# EAGLE design TC4plus (EAGLE 9.1.0)
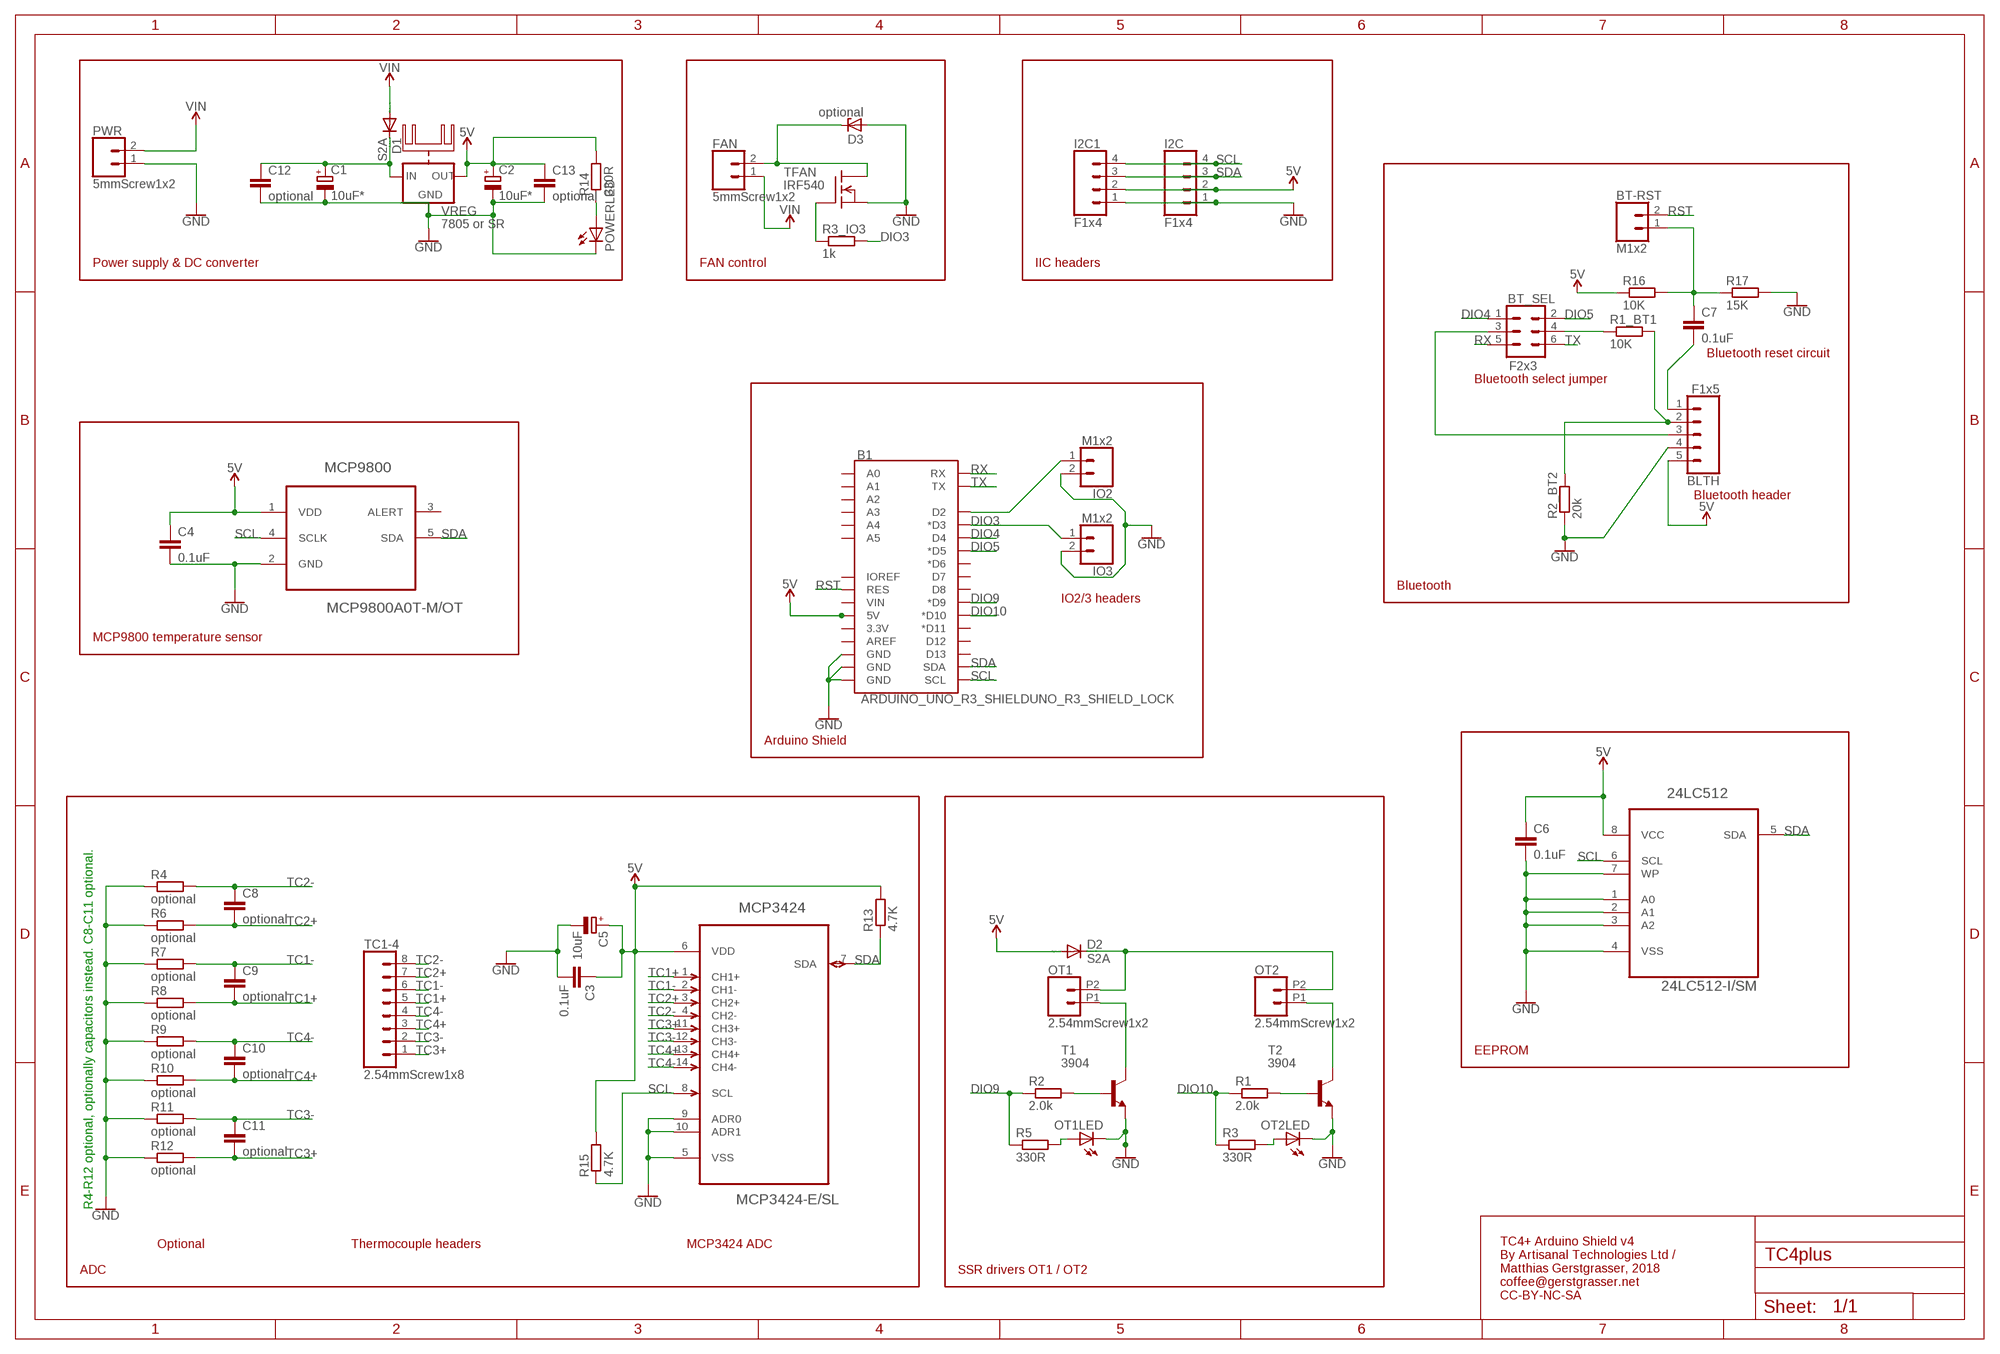
[diagram p0: schematic, sheet 1]

## Parts
24LC512  24LC512-I/SM  [SOIC127P794X203-8N]
B1  ARDUINO_UNO_R3_SHIELDUNO_R3_SHIELD_LOCK  [UNO_R3_SHIELD_LOCK]
BLTH  F1x5  CONN_05LOCK  [1X05_LOCK]
BT-RST  M1x2  CONN_02  [1X02]
BT_SEL  F2x3  CONN_03X2FEMALE  [2X3]
C1  10uF*  CPOL-EUE2-5  [E2-5]
C2  10uF*  CPOL-EUE2-5  [E2-5]
C3  0.1uF  C-EUC0603  [C0603]
C4  0.1uF  C-EUC0603  [C0603]
C5  10uF  CPOL-EUA/3216-18R  [A/3216-18R]
C6  0.1uF  C-EUC0603  [C0603]
C7  0.1uF  C-EUC0603  [C0603]
C8  optional  C-EUC0603  [C0603]
C9  optional  C-EUC0603  [C0603]
C10  optional  C-EUC0603  [C0603]
C11  optional  C-EUC0603  [C0603]
C12  optional  C-EU025-025X050  [C025-025X050]
C13  optional  C-EU025-025X050  [C025-025X050]
D1  S2A  DIODE-DO214AA  [DO214AA]
D2  S2A  DIODE-DO214AA  [DO214AA]
D3  optional  ZENER-DIODESMB  [SMB]
FAN  5mmScrew1x2  CONN_025MM  [SCREWTERMINAL-5MM-2]
I2C  F1x4  CONN_04LOCK  [1X04_LOCK]
I2C1  F1x4  CONN_04LOCK  [1X04_LOCK]
IO2  M1x2  CONN_02  [1X02]
IO3  M1x2  CONN_02  [1X02]
MCP3424  MCP3424-E/SL  [SOIC127P600X175-14N]
MCP9800  MCP9800A0T-M/OT  [SOT95P280X145-5N]
OT1  2.54mmScrew1x2  CONN_022.54MM_SCREWTERM  [1X02_2.54_SCREWTERM]
OT1LED  LEDCHIP-LED0603  [CHIP-LED0603]
OT2  2.54mmScrew1x2  CONN_022.54MM_SCREWTERM  [1X02_2.54_SCREWTERM]
OT2LED  LEDCHIP-LED0603  [CHIP-LED0603]
POWERLED  LEDCHIP-LED0603  [CHIP-LED0603]
PWR  5mmScrew1x2  CONN_025MM  [SCREWTERMINAL-5MM-2]
R1  2.0k  R-EU_R0603  [R0603]
R1_BT1  10K  R-EU_R0603  [R0603]
R2  2.0k  R-EU_R0603  [R0603]
R2_BT2  20k  R-EU_R0603  [R0603]
R3  330R  R-EU_R0603  [R0603]
R3_IO3  1k  R-EU_R0603  [R0603]
R4  optional  R-EU_R0603  [R0603]
R5  330R  R-EU_R0603  [R0603]
R6  optional  R-EU_R0603  [R0603]
R7  optional  R-EU_R0603  [R0603]
R8  optional  R-EU_R0603  [R0603]
R9  optional  R-EU_R0603  [R0603]
R10  optional  R-EU_R0603  [R0603]
R11  optional  R-EU_R0603  [R0603]
R12  optional  R-EU_R0603  [R0603]
R13  4.7K  R-EU_R0603  [R0603]
R14  330R  R-EU_R0603  [R0603]
R15  4.7K  R-EU_R0603  [R0603]
R16  10K  R-EU_R0603  [R0603]
R17  15K  R-EU_R0603  [R0603]
T1  3904  MMBT3904LT1-NPN-SOT23-BEC  [SOT23-BEC]
T2  3904  MMBT3904LT1-NPN-SOT23-BEC  [SOT23-BEC]
TC1-4  2.54mmScrew1x8  CONN_08"  [1X08]
TFAN  IRF540  [TO220]
VREG  7805 or SR  78XXH  [78XXH]

## Nets
5V: 24LC512.8(VCC) B1.5V BLTH.5 C2.+ C3.1 C4.1 C5.+ C6.1 C13.1 D2.A I2C1.2 I2C.2 MCP3424.6(VDD) MCP9800.1(VDD) R13.2 R14.2 R15.2 R16.1 VREG.OUT
DC-: D3.C FAN.2 TFAN.2(D)
DIO3: B1.D3(*D3) IO3.1 R3_IO3.2
DIO4: B1.D4 BT_SEL.1
DIO5: B1.D5(*D5) BT_SEL.2
DIO9: B1.D9(*D9) R2.1 R5.1
DIO10: B1.D10(*D10) R1.1 R3.1
GND: 24LC512.1(A0) 24LC512.2(A1) 24LC512.3(A2) 24LC512.4(VSS) 24LC512.7(WP) B1.GND@0(GND) B1.GND@1(GND) B1.GND@2(GND) BLTH.4 C1.- C2.- C3.2 C4.2 C5.- C6.2 C12.2 C13.2 D3.A I2C1.1 I2C.1 IO2.2 IO3.2 MCP3424.5(VSS) MCP3424.9(ADR0) MCP3424.10(ADR1) MCP9800.2(GND) OT1LED.C OT2LED.C POWERLED.C PWR.1 R2_BT2.1 R4.1 R6.1 R7.1 R8.1 R9.1 R10.1 R11.1 R12.1 R17.2 T1.E T2.E TFAN.3(S) VREG.GND
N$1: R2.2 T1.B
N$2: BLTH.2 R1_BT1.2 R2_BT2.2
N$3: BT_SEL.4 R1_BT1.1
N$4: BLTH.3 BT_SEL.3
N$5: R1.2 T2.B
N$7: R3_IO3.1 TFAN.1(G)
N$11: BLTH.1 C7.2
N$12: OT2LED.A R3.2
N$13: POWERLED.A R14.1
N$14: OT1LED.A R5.2
N$15: BT-RST.1 C7.1 R16.2 R17.1
N$16: C1.+ C12.1 D1.C VREG.IN
N$17: B1.D2 IO2.1
OT1-: OT1.P1 T1.C
OT2-: OT2.P1 T2.C
OT12+: D2.C OT1.P2 OT2.P2
RST: B1.RES BT-RST.2
RX: B1.RX BT_SEL.5
SCL: 24LC512.6(SCL) B1.SCL I2C1.4 I2C.4 MCP3424.8(SCL) MCP9800.4(SCLK) R15.1
SDA: 24LC512.5(SDA) B1.SDA I2C1.3 I2C.3 MCP3424.7(SDA) MCP9800.5(SDA) R13.1
TC1+: C9.2 MCP3424.1(CH1+) R8.2 TC1-4.5
TC1-: C9.1 MCP3424.2(CH1-) R7.2 TC1-4.6
TC2+: C8.2 MCP3424.3(CH2+) R6.2 TC1-4.7
TC2-: C8.1 MCP3424.4(CH2-) R4.2 TC1-4.8
TC3+: C11.2 MCP3424.11(CH3+) R12.2 TC1-4.1
TC3-: C11.1 MCP3424.12(CH3-) R11.2 TC1-4.2
TC4+: C10.2 MCP3424.13(CH4+) R10.2 TC1-4.3
TC4-: C10.1 MCP3424.14(CH4-) R9.2 TC1-4.4
TX: B1.TX BT_SEL.6
VIN: D1.A FAN.1 PWR.2
Unconnected: B1.3.3V B1.A0 B1.A1 B1.A2 B1.A3 B1.A4 B1.A5 B1.AREF B1.D6(*D6) B1.D7 B1.D8 B1.D11(*D11) B1.D12 B1.D13 B1.IOREF B1.VIN MCP9800.3(ALERT)

## Notes on the sheet
- Power supply & DC converter | FAN control | IIC headers
- Bluetooth reset circuit
- Bluetooth select jumper
- Bluetooth header
- Bluetooth
- IO2/3 headers
- MCP9800 temperature sensor
- Arduino Shield
- EEPROM
- R4-R12 optional, optionally capacitors instead. C8-C11 optional.
- Optional | Thermocouple headers | MCP3424 ADC
- ADC | SSR drivers OT1 / OT2
- TC4+ Arduino Shield v4
  By Artisanal Technologies Ltd /
  Matthias Gerstgrasser, 2018
  coffee@gerstgrasser.net
  CC-BY-NC-SA

## Library data of the parts
24LC512 = Microchip_By_element14_Batch_1:24LC512-I/SM: 512K I2C Serial EEPROM; MPN: 24LC512-I/SM; OC_FARNELL: 9758038; OC_NEWARK: 62K0582; PACKAGE: SOIC-8; SUPPLIER: MICROCHIP
B1 = SparkFun-Boards:ARDUINO_UNO_R3_SHIELD: Arduino R3 Shield Footprint Shield form compatible with the Arduino Uno R3. SparkFun Products: MG2639 Cellular Shield <https://www.sparkfun.com/products/13120> MIDI Shield <https://www.sparkfun.com/products/12898> R3 Stackable Headers Kit <https://www.sparkfun.com/products/11417>
BLTH = SparkFun-Connectors:CONN_05: Multi connection point. Often used as Generic Header-pin footprint for 0.1 inch spaced/style header connections On any of the 0.1 inch spaced packages, you can populate with these: Break Away Headers - Straight <https://www.sparkfun.com/products/116> (PRT-00116) Break Away Male Headers - Right Angle <https://www.sparkfun.com/products/553> (PRT-00553) Female Headers <https://www.sparkfun.com/products/115> (PRT-00115) Break Away Headers - Machine Pin <https://www.sparkfun.com/products/117> (PRT-00117) Break Away Female Headers - Swiss Machine Pin <https://www.sparkfun.com/products/743> (PRT-00743) For SCREWTERMINALS and SPRING TERMINALS visit here: Screw Terimnals on SparkFun.com <https://www.sparkfun.com/search/results?term=Screw+Terminals> (5mm/3.5mm/2.54mm spacing) This device is also useful as a general connection point to wire up your design to another part of your project. Our various solder wires solder well into these plated through hole pads. Hook-Up Wire - Assortment (Stranded, 22 AWG) <https://www.sparkfun.com/products/11375> (PRT-11375) Hook-Up Wire - Assortment (Solid Core, 22 AWG) <https://www.sparkfun.com/products/11367> (PRT-11367) View the entire wire category on our website here <https://www.sparkfun.com/categories/141> Special notes: Molex polarized connector foot print use with SKU : PRT-08231 with associated crimp pins and housings. 1MM SMD Version SKU: PRT-10208
BT-RST IO2 IO3 OT1 OT2 = SparkFun-Connectors:CONN_02: Multi connection point. Often used as Generic Header-pin footprint for 0.1 inch spaced/style header connections On any of the 0.1 inch spaced packages, you can populate with these: Break Away Headers - Straight <https://www.sparkfun.com/products/116> (PRT-00116) Break Away Male Headers - Right Angle <https://www.sparkfun.com/products/553> (PRT-00553) Female Headers <https://www.sparkfun.com/products/115> (PRT-00115) Break Away Headers - Machine Pin <https://www.sparkfun.com/products/117> (PRT-00117) Break Away Female Headers - Swiss Machine Pin <https://www.sparkfun.com/products/743> (PRT-00743) For SCREWTERMINALS and SPRING TERMINALS visit here: Screw Terimnals on SparkFun.com <https://www.sparkfun.com/search/results?term=Screw+Terminals> (5mm/3.5mm/2.54mm spacing) This device is also useful as a general connection point to wire up your design to another part of your project. Our various solder wires solder well into these plated through hole pads. Hook-Up Wire - Assortment (Stranded, 22 AWG) <https://www.sparkfun.com/products/11375> (PRT-11375) Hook-Up Wire - Assortment (Solid Core, 22 AWG) <https://www.sparkfun.com/products/11367> (PRT-11367) View the entire wire category on our website here <https://www.sparkfun.com/categories/141> Special notes: Molex polarized connector foot print use with: PRT-08233 with associated crimp pins and housings. 2.54_SCREWTERM for use with PRT-10571. 3.5mm Screw Terminal footprints for PRT-08084 5mm Screw Terminal footprints for use with PRT-08432
BT_SEL = SparkFun-Connectors:CONN_03X2: Multi connection point. Often used as Generic Header-pin footprint for 0.1 inch spaced/style header connections You can populate with any combo of single row headers, but if you'd like an exact match, check these: Header - 2x3 (Male, 0.1") <https://www.sparkfun.com/products/12807> (PRT-12807) Header - 2x3 (Female, 0.1") <https://www.sparkfun.com/products/13010> (PRT-13010) 2x3 Pin Shrouded Header <https://www.sparkfun.com/products/10877> (PRT-10877) On any of the 0.1 inch spaced packages, you can populate with these: Break Away Headers - Straight <https://www.sparkfun.com/products/116> (PRT-00116) Break Away Male Headers - Right Angle <https://www.sparkfun.com/products/553> (PRT-00553) Female Headers <https://www.sparkfun.com/products/115> (PRT-00115) Break Away Headers - Machine Pin <https://www.sparkfun.com/products/117> (PRT-00117) Break Away Female Headers - Swiss Machine Pin <https://www.sparkfun.com/products/743> (PRT-00743) Special note: the shrouded connector mates well with our 3x2 ribbon cables: Ribbon Crimp Connector - 6-pin (2x3, Female) <https://www.sparkfun.com/products/10651> (PRT-10651) Ribbon Cable - 6 wire (15ft) <https://www.sparkfun.com/products/10646> (PRT-10646); PROD_ID: CONN-11566; VALUE: FEMALE 2x3
C1 C2 C5 = rcl:CPOL-EU: POLARIZED CAPACITOR, European symbol; SPICEPREFIX: C
C3 C4 C6-C13 = rcl:C-EU: CAPACITOR, European symbol; SPICEPREFIX: C
D1 D2 = diode:DIODE-: DIODE
D3 = diode:ZENER-DIODE: Z-Diode
FAN PWR = SparkFun-Connectors:CONN_02: Multi connection point. Often used as Generic Header-pin footprint for 0.1 inch spaced/style header connections On any of the 0.1 inch spaced packages, you can populate with these: Break Away Headers - Straight <https://www.sparkfun.com/products/116> (PRT-00116) Break Away Male Headers - Right Angle <https://www.sparkfun.com/products/553> (PRT-00553) Female Headers <https://www.sparkfun.com/products/115> (PRT-00115) Break Away Headers - Machine Pin <https://www.sparkfun.com/products/117> (PRT-00117) Break Away Female Headers - Swiss Machine Pin <https://www.sparkfun.com/products/743> (PRT-00743) For SCREWTERMINALS and SPRING TERMINALS visit here: Screw Terimnals on SparkFun.com <https://www.sparkfun.com/search/results?term=Screw+Terminals> (5mm/3.5mm/2.54mm spacing) This device is also useful as a general connection point to wire up your design to another part of your project. Our various solder wires solder well into these plated through hole pads. Hook-Up Wire - Assortment (Stranded, 22 AWG) <https://www.sparkfun.com/products/11375> (PRT-11375) Hook-Up Wire - Assortment (Solid Core, 22 AWG) <https://www.sparkfun.com/products/11367> (PRT-11367) View the entire wire category on our website here <https://www.sparkfun.com/categories/141> Special notes: Molex polarized connector foot print use with: PRT-08233 with associated crimp pins and housings. 2.54_SCREWTERM for use with PRT-10571. 3.5mm Screw Terminal footprints for PRT-08084 5mm Screw Terminal footprints for use with PRT-08432; SF_SKU: PRT-08432
I2C I2C1 = SparkFun-Connectors:CONN_04: Multi connection point. Often used as Generic Header-pin footprint for 0.1 inch spaced/style header connections On any of the 0.1 inch spaced packages, you can populate with these: Break Away Headers - Straight <https://www.sparkfun.com/products/116> (PRT-00116) Break Away Male Headers - Right Angle <https://www.sparkfun.com/products/553> (PRT-00553) Female Headers <https://www.sparkfun.com/products/115> (PRT-00115) Break Away Headers - Machine Pin <https://www.sparkfun.com/products/117> (PRT-00117) Break Away Female Headers - Swiss Machine Pin <https://www.sparkfun.com/products/743> (PRT-00743) For SCREWTERMINALS and SPRING TERMINALS visit here: Screw Terimnals on SparkFun.com <https://www.sparkfun.com/search/results?term=Screw+Terminals> (5mm/3.5mm/2.54mm spacing) This device is also useful as a general connection point to wire up your design to another part of your project. Our various solder wires solder well into these plated through hole pads. Hook-Up Wire - Assortment (Stranded, 22 AWG) <https://www.sparkfun.com/products/11375> (PRT-11375) Hook-Up Wire - Assortment (Solid Core, 22 AWG) <https://www.sparkfun.com/products/11367> (PRT-11367) View the entire wire category on our website here <https://www.sparkfun.com/categories/141> Special notes: Molex polarized connector foot print use with SKU : PRT-08231 with associated crimp pins and housings. 1MM SMD Version SKU: PRT-10208; PROD_ID: CONN-09696
MCP3424 = Microchip_By_element14_Batch_1:MCP3424-E/SL: Analog-to-Digital Converter; MPN: MCP3424-E/SL; OC_FARNELL: 1630424; OC_NEWARK: 54M4871; PACKAGE: SOIC-14; SUPPLIER: Microchip
MCP9800 = Microchip_By_element14_Batch_1:MCP9800A0T-M/OT: Temperature Sensor; MPN: MCP9800A0T-M/OT; OC_FARNELL: 1439485; OC_NEWARK: 58M8993; PACKAGE: SOT-5; SUPPLIER: MICROCHIP
OT1LED OT2LED POWERLED = led:LED: LED OSRAM: - CHIPLED LG R971, LG N971, LY N971, LG Q971, LY Q971, LO R971, LY R971 LH N974, LH R974 LS Q976, LO Q976, LY Q976 LO Q996 - Hyper CHIPLED LW Q18S LB Q993, LB Q99A, LB R99A - SideLED LS A670, LO A670, LY A670, LG A670, LP A670 LB A673, LV A673, LT A673, LW A673 LH A674 LY A675 LS A676, LA A676, LO A676, LY A676, LW A676 LS A679, LY A679, LG A679 - Hyper Micro SIDELED® LS Y876, LA Y876, LO Y876, LY Y876 LT Y87S - SmartLED LW L88C, LW L88S LB L89C, LB L89S, LG L890 LS L89K, LO L89K, LY L89K LS L896, LA L896, LO L896, LY L896 - TOPLED LS T670, LO T670, LY T670, LG T670, LP T670 LSG T670, LSP T670, LSY T670, LOP T670, LYG T670 LG T671, LOG T671, LSG T671 LB T673, LV T673, LT T673, LW T673 LH T674 LS T676, LA T676, LO T676, LY T676, LB T676, LH T676, LSB T676, LW T676 LB T67C, LV T67C, LT T67C, LS T67K, LO T67K, LY T67K, LW E67C LS E67B, LA E67B, LO E67B, LY E67B, LB E67C, LV E67C, LT E67C LW T67C LS T679, LY T679, LG T679 LS T770, LO T770, LY T770, LG T770, LP T770 LB T773, LV T773, LT T773, LW T773 LH T774 LS E675, LA E675, LY E675, LS T675 LS T776, LA T776, LO T776, LY T776, LB T776 LHGB T686 LT T68C, LB T68C - Hyper Mini TOPLED® LB M676 - Mini TOPLED Santana® LG M470 LS M47K, LO M47K, LY M47K Source: http://www.osram.convergy.de LUXEON: - LUMILED® LXK2-PW12-R00, LXK2-PW12-S00, LXK2-PW14-U00, LXK2-PW14-V00 LXK2-PM12-R00, LXK2-PM12-S00, LXK2-PM14-U00 LXK2-PE12-Q00, LXK2-PE12-R00, LXK2-PE12-S00, LXK2-PE14-T00, LXK2-PE14-U00 LXK2-PB12-K00, LXK2-PB12-L00, LXK2-PB12-M00, LXK2-PB14-N00, LXK2-PB14-P00, LXK2-PB14-Q00 LXK2-PR12-L00, LXK2-PR12-M00, LXK2-PR14-Q00, LXK2-PR14-R00 LXK2-PD12-Q00, LXK2-PD12-R00, LXK2-PD12-S00 LXK2-PH12-R00, LXK2-PH12-S00 LXK2-PL12-P00, LXK2-PL12-Q00, LXK2-PL12-R00 Source: www.luxeon.com KINGBRIGHT: KA-3528ASYC Source: www.kingbright.com
R1 R1_BT1 R2 R2_BT2 R3 R3_IO3 R4-R17 = rcl:R-EU_: RESISTOR, European symbol; SPICEPREFIX: R
T1 T2 = transistor-neu-to92:*-NPN-: NPN Transistror
TC1-4 = SparkFun-Connectors:CONN_08: Multi connection point. Often used as Generic Header-pin footprint for 0.1 inch spaced/style header connections On any of the 0.1 inch spaced packages, you can populate with these: Break Away Headers - Straight <https://www.sparkfun.com/products/116> (PRT-00116) Break Away Male Headers - Right Angle <https://www.sparkfun.com/products/553> (PRT-00553) Female Headers <https://www.sparkfun.com/products/115> (PRT-00115) Break Away Headers - Machine Pin <https://www.sparkfun.com/products/117> (PRT-00117) Break Away Female Headers - Swiss Machine Pin <https://www.sparkfun.com/products/743> (PRT-00743) Arduino Stackable Header - 8 Pin <https://www.sparkfun.com/products/9279> (PRT-09279) For SCREWTERMINALS and SPRING TERMINALS visit here: Screw Terimnals on SparkFun.com <https://www.sparkfun.com/search/results?term=Screw+Terminals> (5mm/3.5mm/2.54mm spacing) This device is also useful as a general connection point to wire up your design to another part of your project. Our various solder wires solder well into these plated through hole pads. Hook-Up Wire - Assortment (Stranded, 22 AWG) <https://www.sparkfun.com/products/11375> (PRT-11375) Hook-Up Wire - Assortment (Solid Core, 22 AWG) <https://www.sparkfun.com/products/11367> (PRT-11367) View the entire wire category on our website here <https://www.sparkfun.com/categories/141> Special notes: Molex polarized connector foot print use with SKU : PRT-08231 with associated crimp pins and housings. 1MM SMD Version SKU: PRT-10208 NOTES ON THE VARIANTS LOCK and LOCK_LONGPADS... This footprint was designed to help hold the alignment of a through-hole component (i.e. 6-pin header) while soldering it into place. You may notice that each hole has been shifted either up or down by 0.005 of an inch from it's more standard position (which is a perfectly straight line). This slight alteration caused the pins (the squares in the middle) to touch the edges of the holes. Because they are alternating, it causes a "brace" to hold the component in place. 0.005 has proven to be the perfect amount of "off-center" position when using our standard breakaway headers. Although looks a little odd when you look at the bare footprint, once you have a header in there, the alteration is very hard to notice. Also,if you push a header all the way into place, it is covered up entirely on the bottom side.; PROD_ID: CONN-08438
TFAN = transistor-fet:IRF540: N-Channel Enhancement MOSFET (HEXFET); 100V; 28A; 0,077Ohm
VREG = 78xx_with_heatsink:78XXH: VOLTAGE REGULATOR

## Board
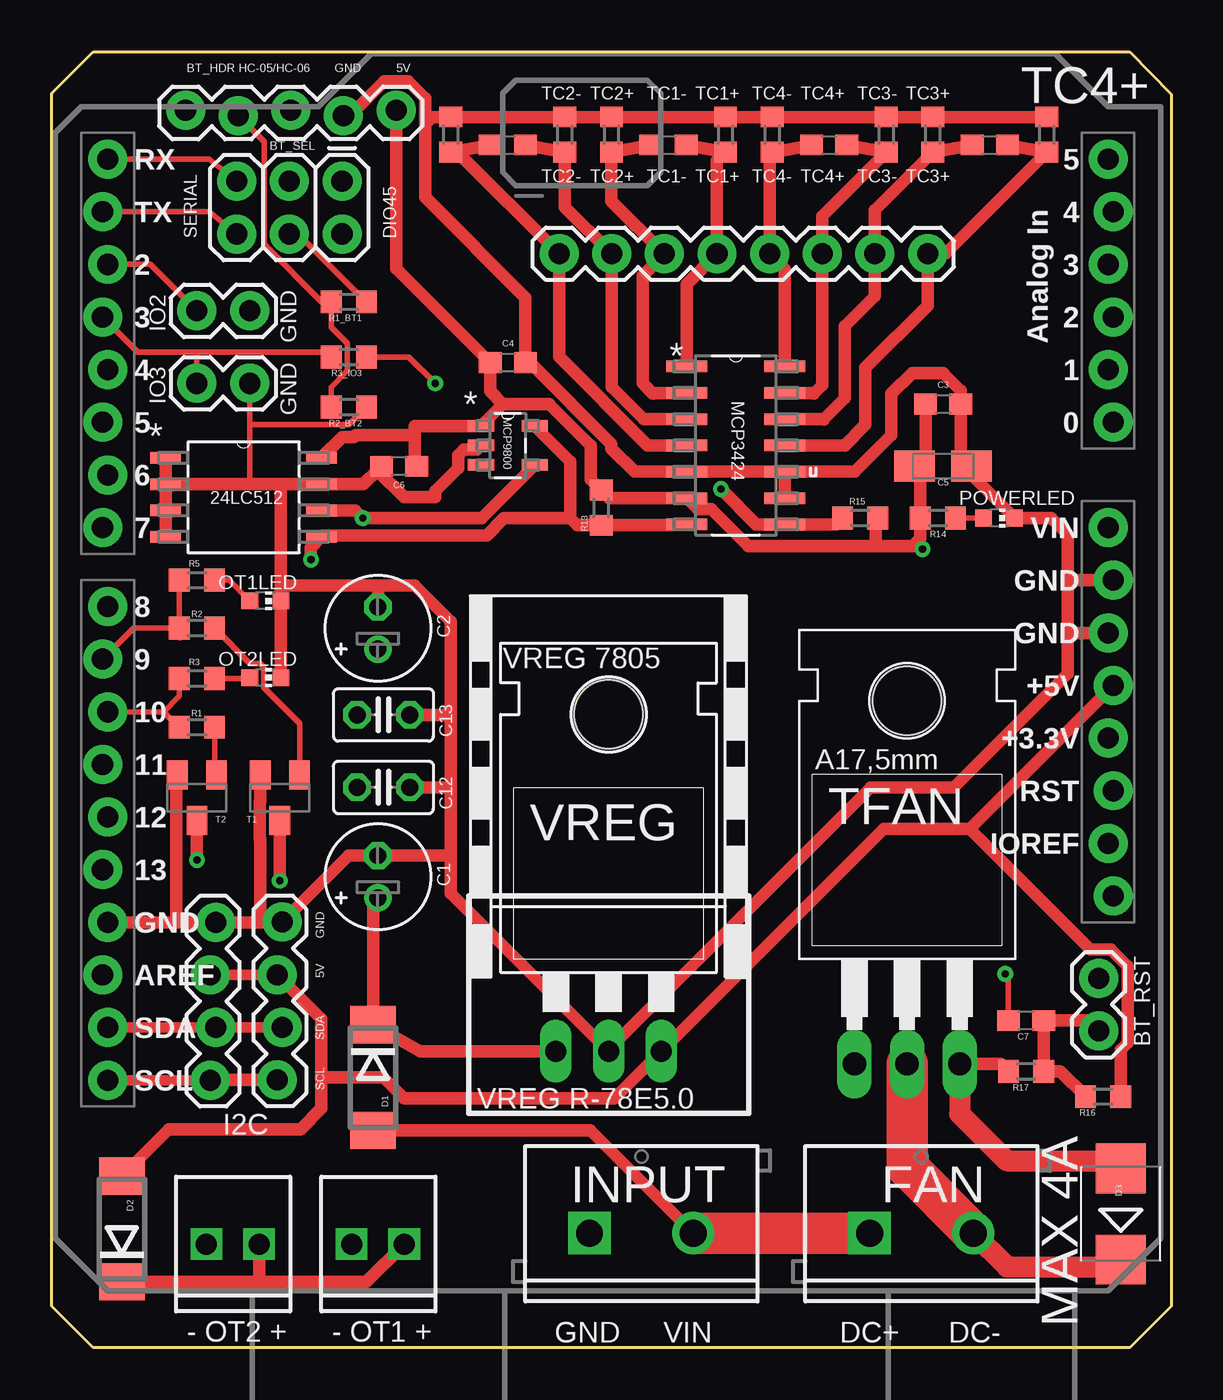
[diagram p1: board, top side]
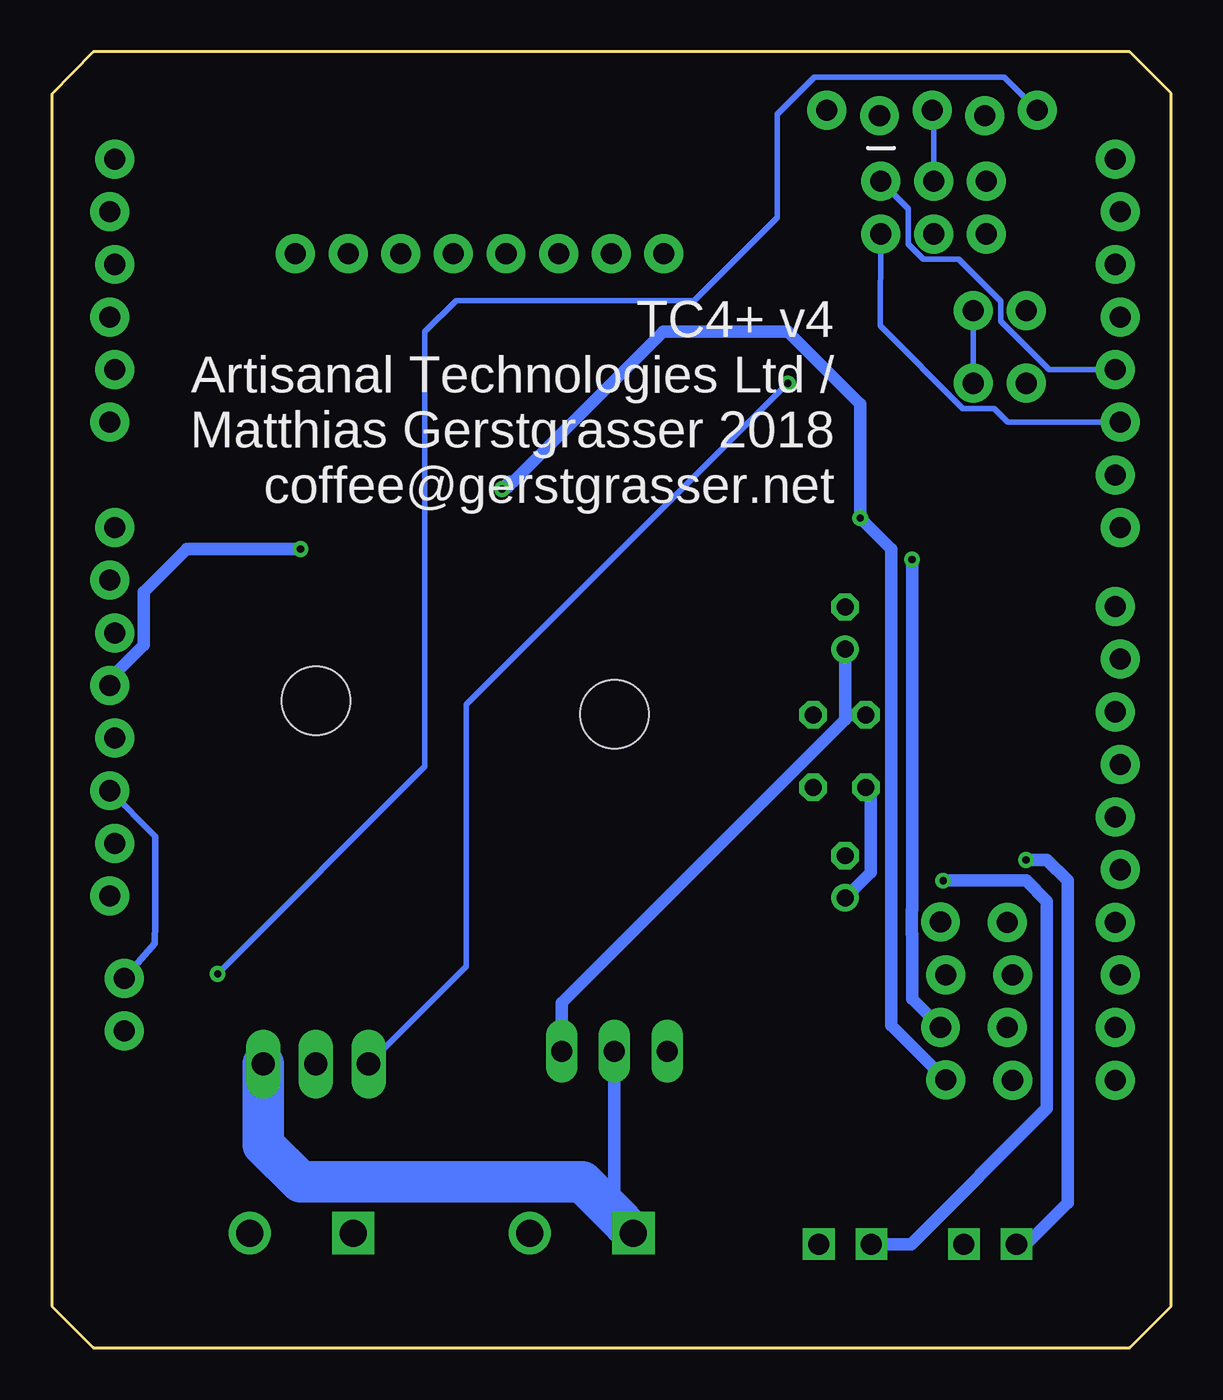
[diagram p2: board, bottom side, seen from below]

Size 54 x 62.54 mm. Coordinates in mm from the lower left corner, seen from the top.
Outline: 54,2 52,0 2,0 0,2 0,60.54 2,62.54 52,62.54 54,60.5 54,2
Copper layers (1*16): Top 0.035mm / dielectric 1.5mm / Bottom 0.035mm
Design rules "default": minimum track width 6mil, minimum drill 0.35mm, track to track 6mil, track to pad 6mil, pad to pad 6mil, via to via 6mil, smd to smd 6mil, copper to edge 40mil, drill to drill 6mil, minimum pad ring 10mil, minimum via ring 8mil, stop-mask expansion 4mil, vias tented up to drill 0mil, thermal gap 10mil

### Footprints (pad centres in the part's own frame; a part is rotated, then mirrored left to right if it is on the bottom)
SOIC127P794X203-8N = smd 1.473 x 0.559: 1 -3.759,1.905; 2 -3.759,0.635; 3 -3.759,-0.635; 4 -3.759,-1.905; 5 3.759,-1.905; 6 3.759,-0.635; 7 3.759,0.635; 8 3.759,1.905
UNO_R3_SHIELD_LOCK = drill 1.016 pad 1.88: 3.3V 24.13,-3.81; 5V 24.384,-1.27; A0 24.384,11.43; A1 24.13,13.97; A2 24.384,16.51; A3 24.13,19.05; A4 24.384,21.59; A5 24.13,24.13; AREF -24.384,-15.24; D2 -24.13,19.05; D3 -24.384,16.51; D4 -24.13,13.97; D5 -24.384,11.43; D6 -24.13,8.89; D7 -24.384,6.35; D8 -24.13,2.54; D9 -24.384,0; D10 -24.13,-2.54; D11 -24.384,-5.08; D12 -24.13,-7.62; D13 -24.384,-10.16; GND@0 24.13,1.27; GND@1 24.384,3.81; GND@2 -24.13,-12.7; IOREF 24.13,-8.89; NC 24.384,-11.43; RES 24.384,-6.35; RX -24.13,24.13; SCL -24.13,-20.32; SDA -24.13,-17.78; TX -24.384,21.59; VIN 24.13,6.35
1X05_LOCK = drill 1.016 pad 1.88: 1 0,0.127; 2 2.54,-0.127; 3 5.08,0.127; 4 7.62,-0.127; 5 10.16,0.127
1X02 = drill 1.016 pad 1.88: 1 0,0; 2 2.54,0
2X3 = drill 1.016 pad 1.88: 1 0,0; 2 0,2.54; 3 2.54,0; 4 2.54,2.54; 5 5.08,0; 6 5.08,2.54
E2-5 = drill 0.813 pad 1.27: + -1.016,0 | drill 0.813 pad 1.27 octagon: - 1.016,0
C0603 = smd 1.1 x 1: 1 -0.85,0; 2 0.85,0
A/3216-18R = smd 1.95 x 1.5: + 1.375,0; - -1.375,0
C025-025X050 = drill 0.813 octagon: 1 -1.27,0; 2 1.27,0
DO214AA = smd 1.8 x 2.2: A 2.55,0; C -2.55,0
SMB = smd 2.4 x 2.4: A 2.2,0; C -2.2,0
SCREWTERMINAL-5MM-2 = drill 1.3 pad 2.032 square: 1 0,0 | drill 1.3 pad 2.032: 2 5,0
1X04_LOCK = drill 1.016 pad 1.88: 1 0,0.127; 2 2.54,-0.127; 3 5.08,0.127; 4 7.62,-0.127
SOIC127P600X175-14N = smd 1.981 x 0.559: 1 -2.362,3.81; 2 -2.362,2.54; 3 -2.362,1.27; 4 -2.362,0; 5 -2.362,-1.27; 6 -2.362,-2.54; 7 -2.362,-3.81; 8 2.362,-3.81; 9 2.362,-2.54; 10 2.362,-1.27; 11 2.362,0; 12 2.362,1.27; 13 2.362,2.54; 14 2.362,3.81
SOT95P280X145-5N = smd 1.27 x 0.559: 1 -1.295,0.94; 2 -1.295,0; 3 -1.295,-0.94; 4 1.295,-0.94; 5 1.295,0.94
1X02_2.54_SCREWTERM = drill 1.016 square: P1 2.54,0; P2 0,0
CHIP-LED0603 = smd 0.8 x 0.8: A 0,-0.75; C 0,0.75
R0603 = smd 1 x 1.1: 1 -0.85,0; 2 0.85,0
SOT23-BEC = smd 1 x 1.4: B -0.95,-1.1; C 0,1.1; E 0.95,-1.1
1X08 = drill 1.016 pad 1.88: 1 0,0; 2 2.54,0; 3 5.08,0; 4 7.62,0; 5 10.16,0; 6 12.7,0; 7 15.24,0; 8 17.78,0
TO220 = drill 1.118 long: 1 -2.54,-6.35; 2 0,-6.35; 3 2.54,-6.35 | hole 3.302: 0,11.176
78XXH = drill 1.016 long: GND 0,-5.08; IN -2.54,-5.08; OUT 2.54,-5.08 | hole 3.302: 0,11.176

### Placement (x,y rotation side)
24LC512  9.25,41.04 0 top
B1  26.83,33.23 0 top
BLTH  6.45,59.59 0 top
BT-RST  50.5,15.29 90 top
BT_SEL  14,56.29 180 top
C1  15.73,22.73 90 top
C2  15.73,34.73 90 top
C3  43,45.54 0 top
C4  22,47.54 0 top
C5  43,42.54 180 top
C6  16.75,42.54 180 top
C7  47,15.79 180 top
C8  22,58.04 0 top
C9  29.75,58.04 0 top
C10  37.5,58.04 0 top
C11  45.25,58.04 0 top
C12  16,27.04 0 top
C13  16,30.54 0 top
D1  15.5,13.04 270 top
D2  3.38,5.73 90 top
D3  51.57,6.46 90 top
FAN  39.45,5.53 0 top
I2C  7.78,20.53 270 top
I2C1  11,20.54 270 top
IO2  7,50.04 0 top
IO3  7,46.54 0 top
MCP3424  33,43.54 0 top
MCP9800  22,43.54 0 top
OT1  17,5 180 top
OT1LED  10.3,36.04 270 top
OT2  10,5 180 top
OT2LED  10.3,32.34 270 top
POWERLED  45.7,40.04 270 top
PWR  25.94,5.53 0 top
R1  7,29.94 0 top
R1_BT1  14.33,50.47 180 top
R2  7,34.73 0 top
R2_BT2  14.33,45.39 180 top
R3  7,32.29 0 top
R3_IO3  14.33,47.81 180 top
R4  19.25,58.54 270 top
R5  7,37.04 0 top
R6  24.75,58.54 270 top
R7  27,58.54 270 top
R8  32.5,58.54 270 top
R9  34.75,58.54 270 top
R10  40.25,58.54 270 top
R11  42.5,58.54 270 top
R12  48,58.54 270 top
R13  26.5,40.54 90 top
R14  42.75,40.04 180 top
R15  39,40.04 0 top
R16  50.72,12.12 180 top
R17  47,13.33 180 top
T1  11,26.54 180 top
T2  7,26.54 180 top
TC1-4  42.25,52.79 180 top
TFAN  41.26,20.04 0 top
VREG  26.86,19.39 0 top

### Tracks (layer width: path | path; a pad name or v marks a point on that pad's centre or on a via)
5V  (via drill 0.35)
  Top 0.305: I2C1.2
  Top 0.508: I2C1.2 7.66,18 I2C.2
  Top 0.61: C3.1 42.15,43.09 C5.+ 41.9,42.24 R14.2 41.9,39.08 41.5,38.68 | D2.A 5.64,10.54 12,10.54 13,11.54 13,13.04 | I2C1.2 13,15.87 13,13.04 | 13,13.04 16,13.04 17,12.04 27.13,12.04 VREG.OUT 40.13,25.04 44.29,25.04 | 44.29,25.04 B1.5V | R16.1 51.57,14.38 51.9,14.71 51.9,18.41 51.08,19.23 50.11,19.23 44.29,25.04 | C6.1 17.5,42.64 17.5,44.04 | 17.5,44.04 17.5,44.48 MCP9800.1 21.77,45.54 | BLTH.5 16.61,52.08 C4.1 21.15,46.15 21.77,45.54 | v42,38.54 41.86,38.68 41.5,38.68 | 21.77,45.54 24,45.54 26,43.54 26,41.89 R13.2 26.89,41 MCP3424.6 31.17,40.47 31.82,40.47 33.61,38.68 39.75,38.68 | 39.75,38.68 41.5,38.68 | 24LC512.8 14.02,43.96 14.57,43.96 14.66,44.04 17.5,44.04 | 39.75,38.68 39.75,39.94 R15.2
  Bottom 0.61: B1.5V 51.21,32.27 49.56,33.92 49.56,36.48 47.5,38.54 v42,38.54 | VREG.OUT 29.4,16.64 15.73,30.31 | C13.1 15.5,30.54 15.73,30.31 | C2.+ 15.73,30.31
DC-
  Top 0.61: FAN.2 44.83,5.91
  Top 1.016: FAN.2 46.09,3.89 51.2,3.89 D3.C
  Top 2: TFAN.2 41.26,8.72 FAN.2
DIO3
  Top 0.254: B1.D3 4.15,48.04 7,48.04 | R3_IO3.2 13.25,48.04 7,48.04 | IO3.1 7,48.04
DIO4
  Bottom 0.254: BT_SEL.1 12.68,54.97 12.68,53.24 11.96,52.53 10.24,52.53 8.22,50.51 8.22,49.54 5.88,47.2 B1.D4
DIO5
  Bottom 0.254: B1.D5 7.88,44.66 8.55,45.32 10.05,45.32 14.04,49.32 BT_SEL.2
DIO9
  Top 0.254: R2.1 6.16,34.24 | B1.D9 3.95,34.73 R2.1 | R2.1 R5.1
DIO10
  Top 0.254: B1.D10 5.4,30.69 | 5.4,30.69 R1.1 | R3.1 6.15,31.44 5.4,30.69
GND
  Top 0.254: 11.68,41.85 11.5,41.68 | 8.54,41.71 8.5,41.68 | IO3.2 9.54,44.54 | 9.54,44.54 9.54,41.71 9.5,41.68 | R2_BT2.1 14.33,44.54 9.54,44.54
  Top 0.61: MCP3424.10 MCP3424.9 | 6,20.53 I2C.1 10,20.53 | 6,20.53 B1.GND@2 2.94,20.53 | 24LC512.4 24LC512.3 24LC512.2 | 24LC512.2 24LC512.1 | 24LC512.2 8.5,41.68 9.5,41.68 11,41.68 | 11,41.68 11.5,41.68 24LC512.7 15.04,41.68 15.7,42.34 | MCP3424.10 MCP3424.5 28.12,42.27 27,43.39 27,43.62 23.08,47.54 C4.2 22.85,50.68 18.01,55.53 18.01,59.04 | R17.2 45.79,13.69 TFAN.3 | 10,20.53 11.12,20.53 I2C1.1 14.33,23.75 C1.- 19.21,23.75 19.25,23.79 | MCP3424.10 38.73,42.27 40.5,44.04 40.5,46.04 41.5,47.04 43,47.04 43.85,46.19 C3.2 43.85,43.09 C5.- 44.4,42.09 POWERLED.C 48.21,40.04 49,39.25 49,36.79 | C6.2 15.7,42.34 | MCP9800.2 20.5,43.34 19.88,43.34 19.61,43.07 19.61,42.45 18.5,41.34 18.5,41.04 17,41.04 15.7,42.34 | OT2LED.C OT1LED.C 11.05,36.79 | 11.05,36.79 11.05,41.62 11,41.68 | 10,20.53 10.05,20.58 10.05,24.54 10.04,24.55 10.04,26.33 10.05,26.34 T1.E | T2.E 6,27.59 6,20.53 | 18.01,59.04 18.01,60.3 17.19,61.11 16.03,61.11 14.38,59.46 BLTH.4 | 18.01,59.04 18.36,59.39 R4.1 R6.1 R7.1 R8.1 R9.1 R10.1 R11.1 R12.1 | 19.25,23.79 19.25,21.92 VREG.GND 26.86,14.4 39.5,27.04 43.5,27.04 49,32.54 49,34.29 | 19.25,23.79 19.25,27.04 | 19.25,27.04 19.25,30.79 | 19.25,30.79 19.25,35.04 17.5,36.79 15.75,36.79 | C12.2 19.25,27.04 | C13.2 19,30.54 19.25,30.79 | 15.75,36.79 11.05,36.79 | C2.- 15.75,35.77 15.75,36.79 | 49,34.29 49,36.79 | B1.GND@1 49.25,37.04 49,36.79 | B1.GND@0 49.21,34.5 49,34.29
  Top 1.016: TFAN.3 43.8,11.29 46.06,9.03 51.2,9.03 D3.A
  Bottom 0.254: IO2.2 IO3.2
  Bottom 0.305: 27.02,5.61 PWR.1
  Bottom 0.61: 28.86,8.45 28.41,8 | VREG.GND 26.86,6.68 26.98,6.56
  Bottom 2: PWR.1 26.98,6.56 28.41,8 42,8 43.8,9.8 TFAN.3
N$1
  Top 0.254: T1.B 11.95,30.13 10.23,31.85 10.23,32.86 10.07,33.02 9.56,33.02 R2.2
N$2
  Top 0.254: R2_BT2.2 13.48,46.37 14.26,47.14 14.26,48.48 13.48,49.26 R1_BT1.2 13.02,50.47 10.24,53.24 10.24,56.79 10.25,56.8 10.25,58.2 BLTH.2
N$3
  Top 0.254: R1_BT1.1 11.9,53.75 BT_SEL.4
N$4
  Bottom 0.254: BLTH.3 11.46,59.62 BT_SEL.3
N$5
  Top 0.254: R1.2 7.85,27.74 T2.B
N$7  (via drill 0.35)
  Top 0.254: R3_IO3.1 17.23,47.81 v18.5,46.54
  Bottom 0.254: v18.5,46.54 34,31.04 34,18.41 TFAN.1
N$11  (via drill 0.35)
  Top 0.254: C7.2 46.15,17.89 v46,18.04
  Bottom 0.254: BLTH.1 8.05,61.32 17.22,61.32 19,59.54 19,54.54 23,50.54 34.5,50.54 36,49.04 36,28.04 v46,18.04
N$12
  Top 0.254: R3.2 9.5,32.29 OT2LED.A
N$13
  Top 0.254: R14.1 POWERLED.A
N$14
  Top 0.254: R5.2 8.55,37.04 OT1LED.A
N$15
  Top 0.61: R16.2 48.66,13.33 R17.1 C7.1 50,15.79 BT-RST.1
N$16
  Top 0.61: VREG.IN 17.78,14.31 D1.C 15.5,21.48 C1.+
  Bottom 0.61: C1.+ 14.5,22.94 14.5,26.81 C12.1
N$17
  Top 0.254: IO2.1 4.76,52.28 B1.D2
OT1-  (via drill 0.35)
  Top 0.61: T1.C v11,22.54
  Bottom 0.61: v11,22.54 7,22.54 6,21.54 6,11.54 12.54,5 OT1.P1
OT2-  (via drill 0.35)
  Top 0.61: T2.C v7,23.54
  Bottom 0.61: v7,23.54 6,23.54 5,22.54 5,7 7,5 OT2.P1
OT12+
  Top 0.61: D2.C 10,3.18 | 10,3.18 15.18,3.18 OT1.P2 | OT2.P2 10,3.18
RST
  Bottom 0.305: BT-RST.2 49.04,19.5 49,20.54 49,24.67 B1.RES
RX
  Top 0.254: B1.RX 7.6,57.36 BT_SEL.5
SCL  (via drill 0.35)
  Top 0.508: B1.SCL I2C.4
  Top 0.61: I2C.4 7.66,12.92 I2C1.4 | 24LC512.6 14.64,40.4 v15,40.04 20.73,40.04 MCP9800.4 | v32.29,41.43 33.99,39.73 MCP3424.8 37.84,39.73 R15.1
  Bottom 0.61: I2C1.4 13.5,15.55 13.5,38.54 v15,40.04 15,45.54 18.5,49.04 24.5,49.04 31.75,41.79 | 31.75,41.79 32,41.54 | v32.29,41.43 31.93,41.79 31.75,41.79
SDA  (via drill 0.35)
  Top 0.508: B1.SDA I2C.3 11.12,15.45 I2C1.3
  Top 0.61: v12.5,38.04 12.5,38.63 24LC512.5 13.08,39.21 20.98,39.21 21.81,40.04 25,40.04 | MCP9800.5 25,42.77 25,40.04 | 25,40.04 25.35,39.69 R13.1 30.6,39.69 MCP3424.7
  Bottom 0.61: I2C1.3 12.5,16.83 12.5,19.94 12.52,19.96 12.52,21.12 12.5,21.14 v12.5,38.04
TC1+
  Top 0.61: C9.2 R8.2 32.09,57.28 TC1-4.5 30.64,51.34 MCP3424.1
TC1-
  Top 0.61: C9.1 R7.2 27,55.34 TC1-4.6 28.5,51.74 28.5,46.54 29,46.04 29.04,46.08 MCP3424.2
TC2+
  Top 0.61: C8.2 R6.2 24.75,55.05 TC1-4.7 27.01,46.36 28.56,44.81 MCP3424.3
TC2-
  Top 0.61: C8.1 R4.2 19.57,57.69 TC1-4.8 24.47,47.82 28.75,43.54 MCP3424.4
TC3+
  Top 0.61: C11.2 R12.2 43.1,52.79 TC1-4.1 42.25,50.29 39.25,47.29 39.25,44.54 38.25,43.54 MCP3424.11
TC3-
  Top 0.61: C11.1 R11.2 39.71,54.9 TC1-4.2 39.71,50.75 38.25,49.29 38.25,45.83 37.23,44.81 | MCP3424.12 37.23,44.81 | 37.23,44.81 37.25,44.79
TC4+
  Top 0.61: C10.2 R10.2 37.17,54.61 TC1-4.3 37.17,46.46 36.75,46.04 36.71,46.08 MCP3424.13
TC4-
  Top 0.61: C10.1 34.97,57.73 | 34.97,57.73 R9.2 | MCP3424.14 35.36,52.06 TC1-4.4 34.63,57.4 34.97,57.73
TX
  Top 0.254: B1.TX 7.6,54.82 BT_SEL.6
VIN
  Top 0.61: PWR.2 25.98,10.49 D1.A
  Top 2: PWR.2 FAN.1

### Text on the board
tPlace: BT_HDR HC-05/HC-06 GND 5V | TC2- | TC2+ | TC1- | TC1+ | TC4- | TC4+ | TC3- | TC3+ | TC4+ | BT_SEL | TC2- | TC2+ | TC1- | TC1+ | TC4- | TC4+ | TC3- | TC3+ | DIO45 | SERIAL | GND | IO2 | GND | IO3 | VREG 7805 | GND | 5V | SDA | BT_RST | SCL | VREG R-78E5.0 | INPUT | FAN | - OT2 + | - OT1 + | GND | VIN | DC+ | DC- | MAX 4A
bPlace: TC4+ v4 / Artisanal Technologies Ltd / / Matthias Gerstgrasser 2018 / coffee@gerstgrasser.net
tNames: I2C